# EAGLE design placa (EAGLE 7.6.0)
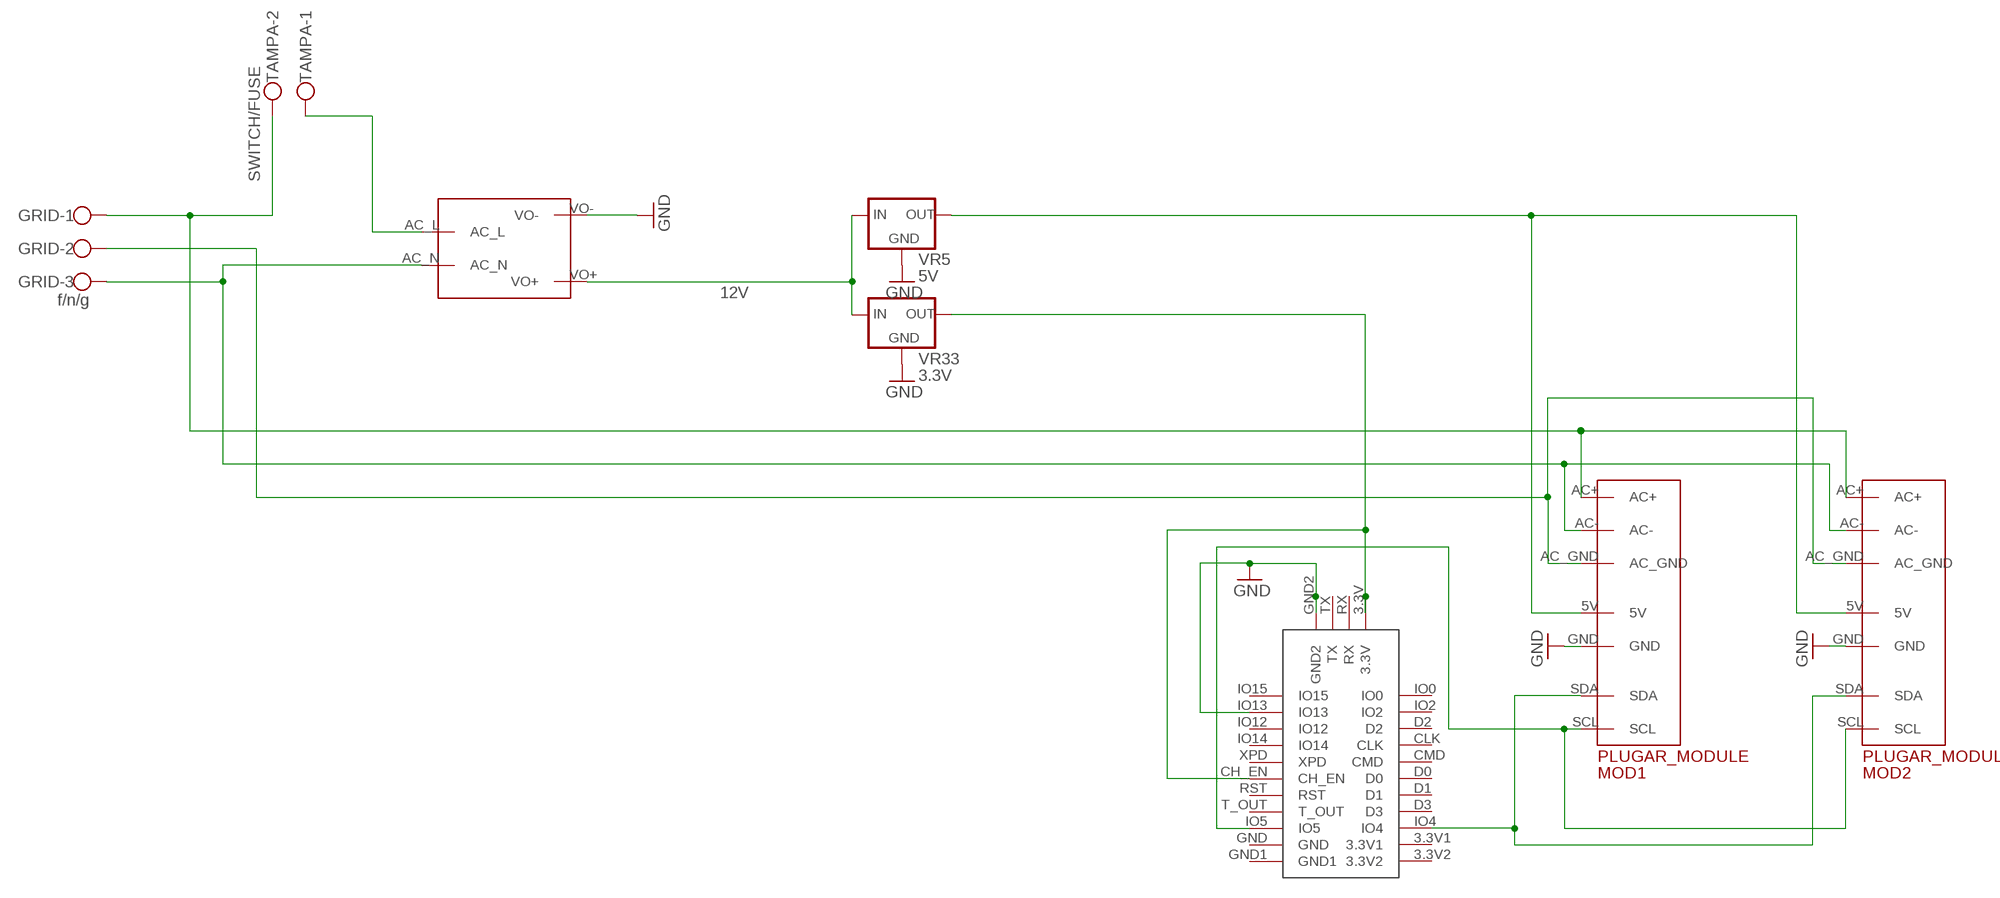
[diagram p0: schematic, sheet 1]

## Parts
GRID  f/n/g  W237-103  [W237-103]
MOD1  PLUGARPADS  [PLUGAR]
MOD2  PLUGARPADS  [PLUGAR]
TAMPA  SWITCH/FUSE  W237-102  [W237-102]
U$1  MAINS_CONVERTERS  [HLK-PM01]
U$2  ESP-201  [ESP-201]
VR5  5V  78LXX  [78LXX]
VR33  3.3V  78LXX  [78LXX]

## Nets
3.3V: U$2.3.3V U$2.CH_EN VR33.OUT
5V: MOD1.5V MOD2.5V VR5.OUT
12V: U$1.VO+ VR5.IN VR33.IN
AC+: GRID.1 MOD1.AC+ MOD2.AC+ TAMPA.2
AC-: GRID.3 MOD1.AC- MOD2.AC- U$1.AC_N
AC_GND: GRID.2 MOD1.AC_GND MOD2.AC_GND
GND: MOD1.GND MOD2.GND U$1.VO- U$2.GND2 U$2.IO13 VR5.GND VR33.GND
N$2: TAMPA.1 U$1.AC_L
SCL: MOD1.SCL MOD2.SCL U$2.IO5
SDA: MOD1.SDA MOD2.SDA U$2.IO4
Unconnected: U$2.3.3V1 U$2.3.3V2 U$2.CLK U$2.CMD U$2.D0 U$2.D1 U$2.D2 U$2.D3 U$2.GND U$2.GND1 U$2.IO0 U$2.IO2 U$2.IO12 U$2.IO14 U$2.IO15 U$2.RST U$2.RX U$2.T_OUT U$2.TX U$2.XPD

## Library data of the parts
GRID = con-wago-500:W237-103: WAGO SCREW CLAMP; MPN: 237-103; OC_FARNELL: unknown; OC_NEWARK: 18M7116
MOD1 MOD2 = PLUGAR_pads:PLUGARPADS
TAMPA = con-wago-500:W237-102: WAGO SCREW CLAMP; MPN: 237-102; OC_FARNELL: unknown; OC_NEWARK: 70K9898
U$1 = captain-slow:MAINS_CONVERTERS
U$2 = PLUGAR_pads:ESP-201
VR5 VR33 = v-reg:78LXX: VOLTAGE REGULATOR

## Net classes
0 default: width 0.305 mm, drill 0.508 mm, clearance 0.203 mm

## Board
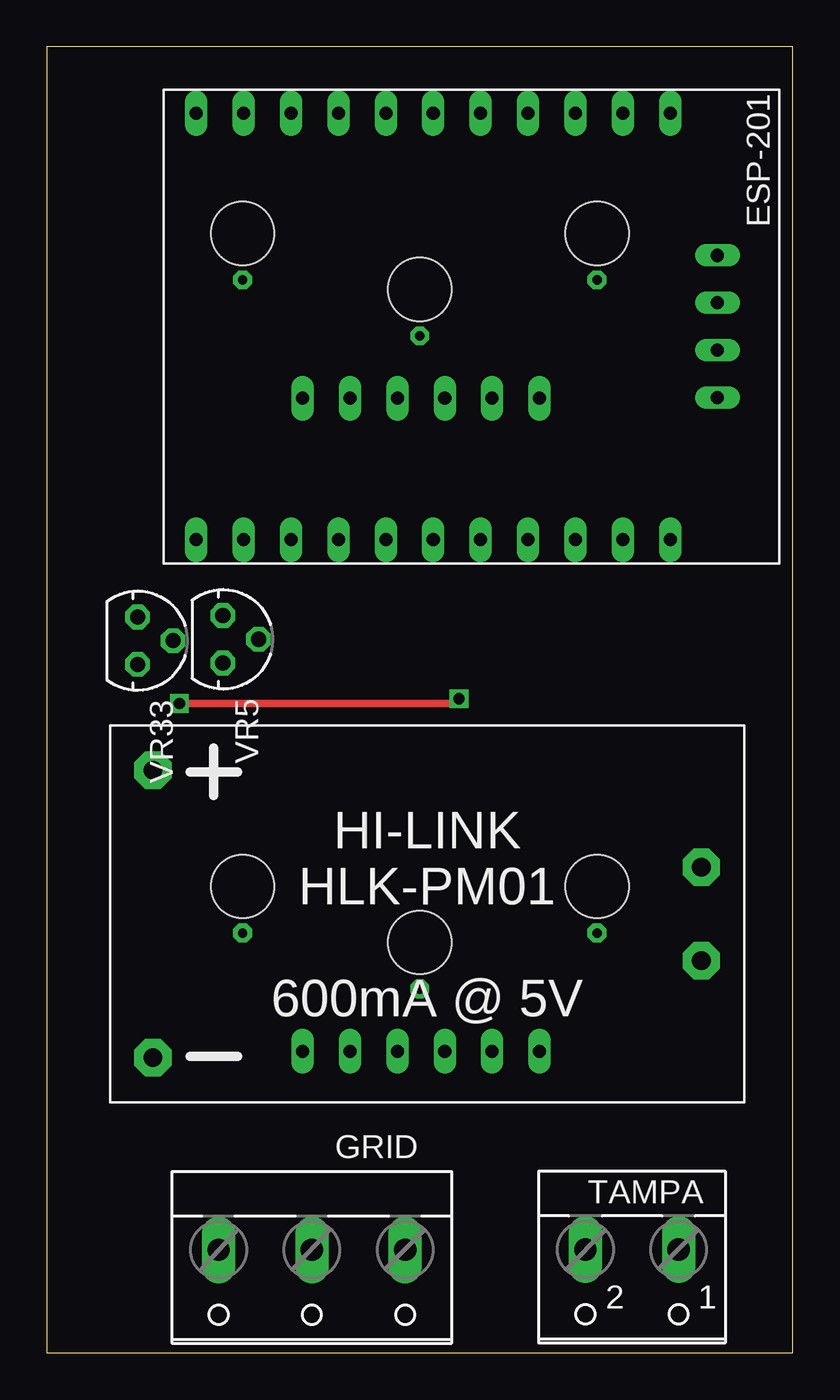
[diagram p1: board, top side]
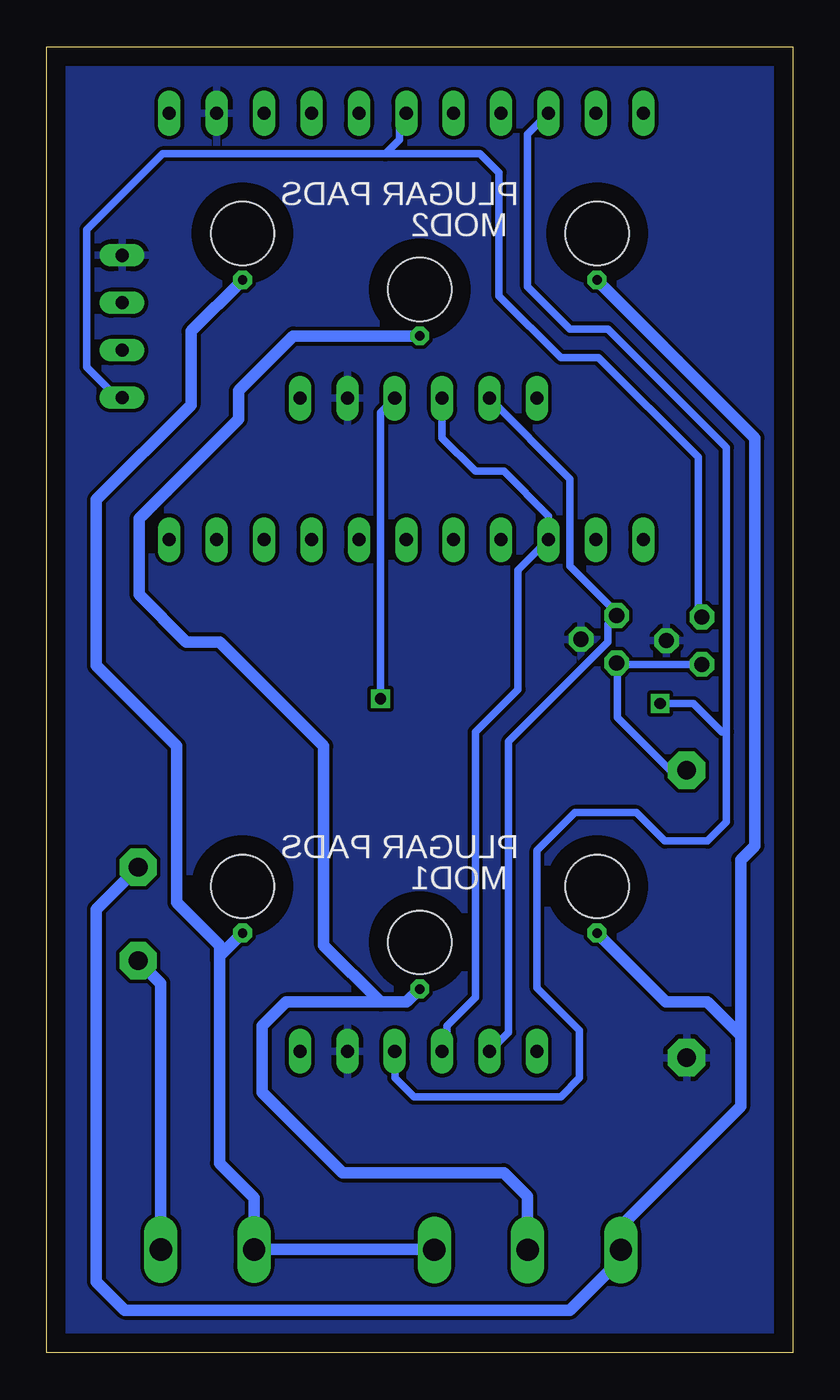
[diagram p2: board, bottom side, seen from below]

Size 40 x 70 mm. Coordinates in mm from the lower left corner, seen from the top.
Outline: 0,0 40,0 40,70 0,70 0,0
Copper layers (1*16): Top 0.035mm / dielectric 1.5mm / Bottom 0.035mm
Design rules "default": minimum track width 10mil, minimum drill 24mil, track to track 8mil, track to pad 8mil, pad to pad 8mil, via to via 8mil, smd to smd 8mil, copper to edge 40mil, drill to drill 8mil, minimum pad ring 10mil, minimum via ring 8mil, stop-mask expansion 4mil, vias tented up to drill 0mil, thermal gap 10mil

### Footprints (pad centres in the part's own frame; a part is rotated, then mirrored left to right if it is on the bottom)
W237-103 = drill 1.194 long: 1 -5,-1.29; 2 0,-1.29; 3 5,-1.29
PLUGAR = drill 0.7 long: 5V -3.74,-5.84; AUX1 6.42,-5.84; AUX2 -6.28,-5.84; GND 3.88,-5.84; SCL 1.34,-5.84; SDA -1.2,-5.84 | drill 0.5 pad 0.61 octagon: AC+ 9.5,0.5; AC- -9.5,0.5; AC_GND 0,-2.5 | hole 3.4: 0,0; 9.5,3; -9.5,3
W237-102 = drill 1.194 long: 1 -2.5,-1.27; 2 2.5,-1.27
HLK-PM01 = drill 1 pad 2 octagon: AC_L -14.7,2.5; AC_N -14.7,-2.5; VO+ 14.7,-7.7; VO- 14.7,7.7
ESP-201 = drill 0.7 pad 0.813 long: 3.3V 3.81,12.7; 3.3V1 11.43,-12.7; 3.3V2 11.43,-15.24; CH_EN -11.43,-2.54; CLK 11.43,2.54; CMD 11.43,0; D0 11.43,-2.54; D1 11.43,-5.08; D2 11.43,5.08; D3 11.43,-7.62; GND -11.43,-12.7; GND1 -11.43,-15.24; GND2 -3.81,12.7; IO0 11.43,10.16; IO2 11.43,7.62; IO4 11.43,-10.16; IO5 -11.43,-10.16; IO12 -11.43,5.08; IO13 -11.43,7.62; IO14 -11.43,2.54; IO15 -11.43,10.16; RST -11.43,-5.08; RX 1.27,12.7; T_OUT -11.43,-7.62; TX -1.27,12.7; XPD -11.43,0
78LXX = drill 0.813 octagon: GND 0,1.905; IN 1.27,0; OUT -1.27,0

### Placement (x,y rotation side)
GRID  14.22,4.23 180 top
MOD1  20,22 0 top
MOD2  20,57 0 top
TAMPA  31.38,4.27 180 top
U$1  20.39,23.52 180 top
U$2  23.26,55 270 top
VR5  9.45,38.24 270 top
VR33  4.87,38.17 270 top

### Tracks (layer width: path | path; a pad name or v marks a point on that pad's centre or on a via)
3.3V
  Bottom 0.406: VR33.OUT 5.08,39.64 5.08,48.01 10.41,53.34 12.45,53.34 15.75,56.64 15.75,63.25 16.76,64.26 21.84,64.26 | 21.84,64.26 33.78,64.26 37.85,60.2 37.85,52.83 36.21,51.19 U$2.3.3V 35.7,51.19 | U$2.CH_EN 21.08,66.07 21.08,65.02 21.84,64.26
5V
  Bottom 0.406: MOD1.5V 15.24,17.18 15.24,32.77 9.91,38.1 9.91,39.05 VR5.OUT 9.45,39.68 11.94,42.16 11.94,46.84 MOD2.5V
12V
  Bottom 0.406: VR5.IN 9.4,36.92 | 9.4,36.92 9.4,34.04 6.58,31.22 U$1.VO+ | 9.4,36.92 9.38,36.9 VR33.IN
AC+
  Bottom 0.61: GRID.1 19.24,5.54 TAMPA.2 28.88,8.31 30.73,10.16 30.73,21.08 30.73,21.27 | MOD1.AC+ 30.73,21.27 | MOD2.AC+ 32.26,54.74 32.26,50.8 37.34,45.72 37.34,36.83 33.02,32.51 33.02,24.13 30.73,21.84 30.73,21.27
AC-
  Bottom 0.61: MOD1.AC- 6.8,18.8 4.57,18.8 2.79,17.02 | 2.79,17.02 2.79,16.76 2.79,13.21 9.22,6.78 GRID.3 9.22,5 11.94,2.29 35.81,2.29 37.34,3.81 37.34,23.77 U$1.AC_N | MOD2.AC- 2.03,49.03 2.03,27.18 2.79,26.42 2.79,17.02
AC_GND
  Bottom 0.61: 22.1,18.8 27.18,18.8 28.45,17.53 28.45,13.97 24.13,9.65 15.49,9.65 14.22,8.38 GRID.2 | MOD1.AC_GND 20.7,18.8 22.1,18.8 | 22.1,18.8 25.15,21.84 25.15,32.51 30.73,38.1 32.51,38.1 35.05,40.64 35.05,44.7 29.72,50.04 29.72,51.56 26.78,54.5 MOD2.AC_GND
GND
  pour Bottom: 41,70.5 -0.5,70.5 -0.5,-0.5 41,-0.5
N$2
  Bottom 0.61: U$1.AC_L 33.88,19.8 TAMPA.1
SCL  (via drill 0.6)
  Top 0.406: v22.1,35.05 21.84,34.8 v7.11,34.8
  Bottom 0.406: MOD1.SCL 21.34,14.73 20.32,13.72 12.45,13.72 11.43,14.73 11.43,17.27 13.72,19.56 13.72,26.92 11.68,28.96 8.38,28.96 6.86,27.43 4.57,27.43 3.56,28.45 3.56,33.27 | 3.56,33.27 3.56,48.51 9.91,54.86 11.94,54.86 14.22,57.15 14.22,65.31 U$2.IO5 | MOD2.SCL 22.1,50.39 v22.1,35.05 | v7.11,34.8 5.33,34.8 3.81,33.27 3.56,33.27
SDA
  Bottom 0.406: MOD2.SDA 18.8,49.02 17.02,47.24 15.49,47.24 13.1,44.85 U$2.IO4 14.73,41.94 14.73,35.56 17.02,33.27 17.02,19.05 18.54,17.53 18.54,16.42 MOD1.SDA